# EAGLE design Sensorboard1 (EAGLE 9.2.2)
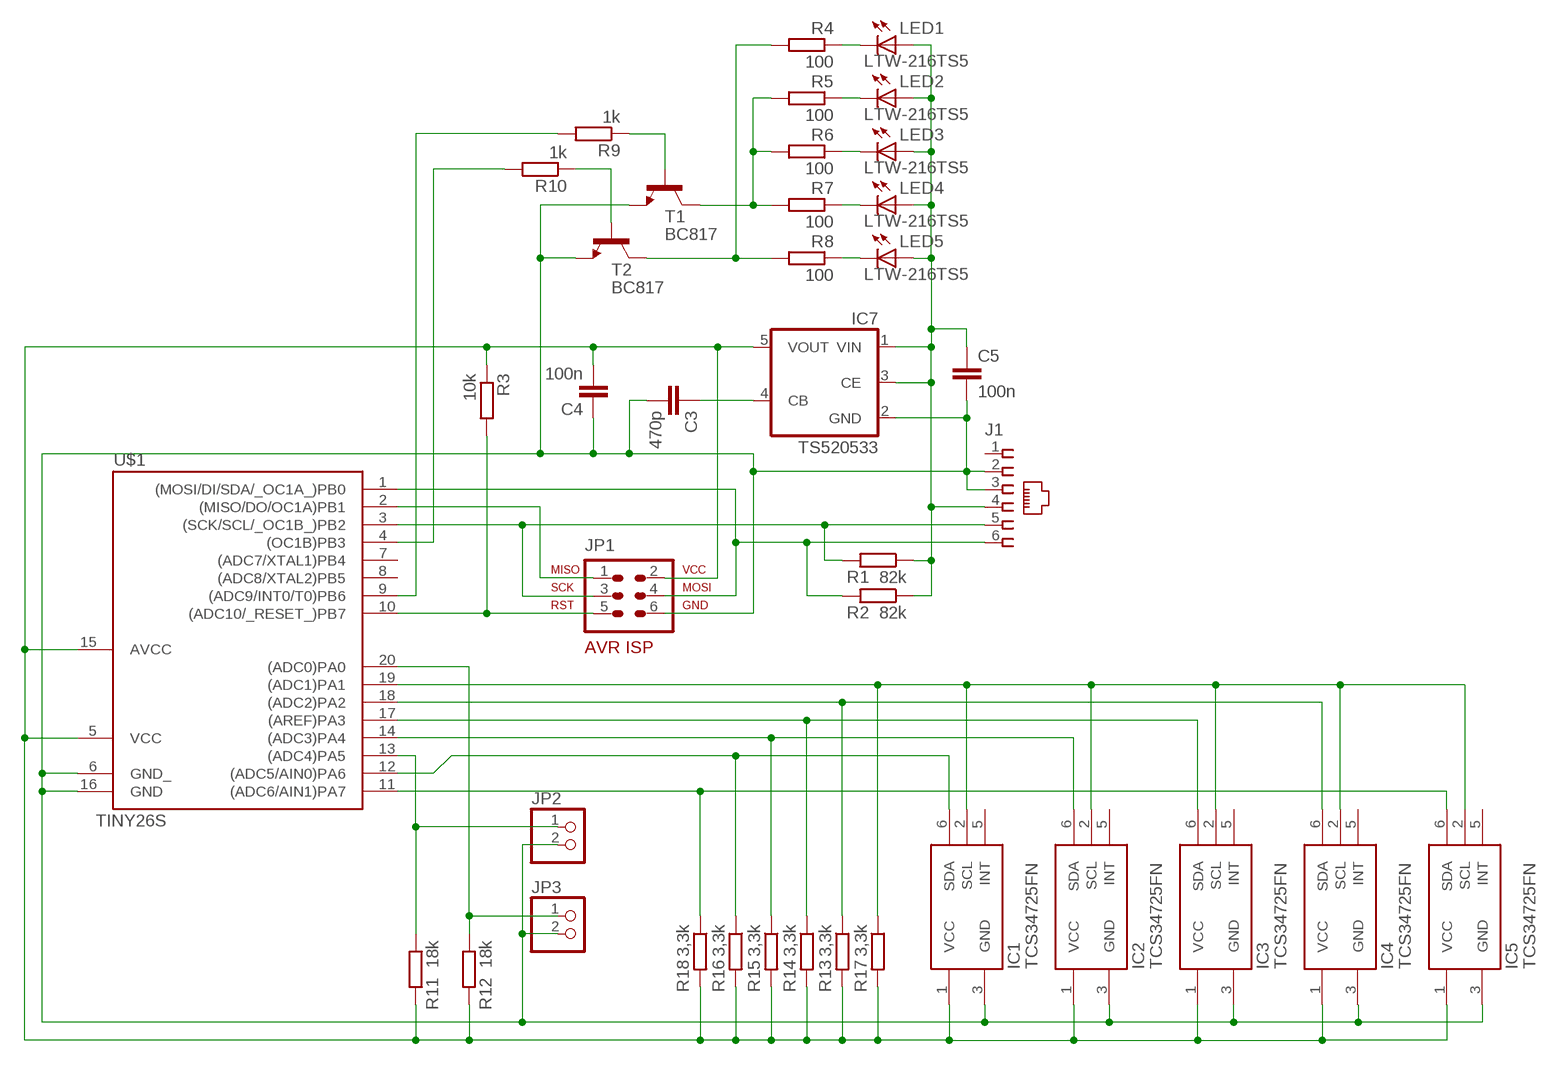
[diagram p0: schematic, sheet 1]

## Parts
C3  470p  C-EUC2012  [C2012]
C4  100n  C-EUC2012  [C2012]
C5  100n  C-EUC2012  [C2012]
IC1  TCS34725FN  TCS3472FN  [DFN-6]
IC2  TCS34725FN  TCS3472FN  [DFN-6]
IC3  TCS34725FN  TCS3472FN  [DFN-6]
IC4  TCS34725FN  TCS3472FN  [DFN-6]
IC5  TCS34725FN  TCS3472FN  [DFN-6]
IC7  TS520533  [SOT25]
J1  NXT  [NXT]
JP1  AVR-ISP-6VERT  [AVR-ISP-6]
JP2  PINHD-1X2  [1X02]
JP3  PINHD-1X2  [1X02]
LED1  LTW-216TS5  LEDCHIPLED_1206  [CHIPLED_1206]
LED2  LTW-216TS5  LEDCHIPLED_1206  [CHIPLED_1206]
LED3  LTW-216TS5  LEDCHIPLED_1206  [CHIPLED_1206]
LED4  LTW-216TS5  LEDCHIPLED_1206  [CHIPLED_1206]
LED5  LTW-216TS5  LEDCHIPLED_1206  [CHIPLED_1206]
R1  82k  R-EU_M0805  [M0805]
R2  82k  R-EU_M0805  [M0805]
R3  10k  R-EU_M0805  [M0805]
R4  100  R-EU_M0805  [M0805]
R5  100  R-EU_M0805  [M0805]
R6  100  R-EU_M0805  [M0805]
R7  100  R-EU_M0805  [M0805]
R8  100  R-EU_M0805  [M0805]
R9  1k  R-EU_M0805  [M0805]
R10  1k  R-EU_M0805  [M0805]
R11  18k  R-EU_M0805  [M0805]
R12  18k  R-EU_M0805  [M0805]
R13  3,3k  R-EU_M0805  [M0805]
R14  3,3k  R-EU_M0805  [M0805]
R15  3,3k  R-EU_M0805  [M0805]
R16  3,3k  R-EU_M0805  [M0805]
R17  3,3k  R-EU_M0805  [M0805]
R18  3,3k  R-EU_M0805  [M0805]
T1  BC817  BC846  [SOT23]
T2  BC817  BC846  [SOT23]
U$1  TINY26S  [SO20L$]

## Nets
3,3V: C4.2 IC1.1(VCC) IC2.1(VCC) IC3.1(VCC) IC4.1(VCC) IC5.1(VCC) IC7.5(VOUT) JP1.2 R3.1 R11.2 R12.2 R13.2 R14.2 R15.2 R16.2 R17.2 R18.2 U$1.5(VCC) U$1.15(AVCC)
4,3V: C5.1 IC7.1(VIN) IC7.3(CE) J1.4 LED1.A LED2.A LED3.A LED4.A LED5.A R1.1 R2.1
GND: C3.2 C4.1 C5.2 IC1.3(GND) IC2.3(GND) IC3.3(GND) IC4.3(GND) IC5.3(GND) IC7.2(GND) J1.2 J1.3 JP1.6 JP2.2 JP3.2 T1.2(E) T2.2(E) U$1.6(GND_) U$1.16(GND)
MISO: JP1.1 U$1.2((MISO/DO/OC1A)PB1)
N$1: LED1.C R4.1
N$2: LED2.C R5.1
N$3: LED3.C R6.1
N$4: LED4.C R7.1
N$5: LED5.C R8.1
N$6: R5.2 R6.2 R7.2 T1.3(C)
N$7: C3.1 IC7.4(CB)
N$8: R9.2 U$1.9((ADC9/INT0/T0)PB6)
N$9: R9.1 T1.1(B)
N$10: R4.2 R8.2 T2.3(C)
N$11: R10.1 T2.1(B)
N$12: R10.2 U$1.4((OC1B)PB3)
N$14: JP2.1 R11.1 U$1.13((ADC4)PA5)
N$15: JP3.1 R12.1 U$1.20((ADC0)PA0)
RESET: JP1.5 R3.2 U$1.10((ADC10/_RESET_)PB7)
SCL: IC1.2(SCL) IC2.2(SCL) IC3.2(SCL) IC4.2(SCL) IC5.2(SCL) R17.1 U$1.19((ADC1)PA1)
SCL/SCK: J1.5 JP1.3 R1.2 U$1.3((SCK/SCL/_OC1B_)PB2)
SDA1: IC1.6(SDA) R16.1 U$1.12((ADC5/AIN0)PA6)
SDA2: IC2.6(SDA) R15.1 U$1.14((ADC3)PA4)
SDA3: IC3.6(SDA) R14.1 U$1.17((AREF)PA3)
SDA4: IC4.6(SDA) R13.1 U$1.18((ADC2)PA2)
SDA5: IC5.6(SDA) R18.1 U$1.11((ADC6/AIN1)PA7)
SDA/MOSI: J1.6 JP1.4 R2.2 U$1.1((MOSI/DI/SDA/_OC1A_)PB0)
Unconnected: IC1.5(INT) IC2.5(INT) IC3.5(INT) IC4.5(INT) IC5.5(INT) J1.1 U$1.7((ADC7/XTAL1)PB4) U$1.8((ADC8/XTAL2)PB5)

## Library data of the parts
C3-C5 = resistor:C-EU: CAPACITOR, European symbol
IC1-IC5 = HyperTriangle:TCS3472: The TAOS inc. TCS3472 device provides a digital return of red, green, blue (RGB), and clear light sensing values. An IR blocking filter, integrated on-chip and localized to the color sensing photodiodes, minimizes the IR spectral wide component dynamic of the range, incoming and IR light blocking and allows filter make color measurements the TCS3472 an to ideal be made color accurately. sensor solution The high for sensitivity, use under varying lighting conditions and through attenuating materials. The TCS3472 color sensor has a wide range of applications including RGB LED backlight control, solid-state lighting, IR blocking health/fitness filter enables products, the TCS3472 industrial to perform processambient controls light and sensing medical (ALS). diagnostic Ambient equipment. light sensing In addition, is widely the used enable inautomatic display-based display products brightness such for as cell optimal phones, viewing notebooks, and power and savings. TVs to sense The TCS3472, the lighting itself, environment can enter and lower-power wait state between light sensing measurements to further reduce the average power consumption.
IC7 = v-reg:TS5205: 150mA Low Noise LDO Voltage Regulator with Enable TSC [Taiwan Semiconductor Company, Ltd] Source: http://www.taiwansemi.com .. 5205_0409c.pdf
J1 = NXT:NXT: 6 Pin RJ-12 Connector for Lego Mindstorms NXT 6/6 Western Telephone Jack
JP1 = avr-7:AVR-ISP-6: AVR ISP-6 Serial Programming Header
JP2 JP3 = pinhead:PINHD-1X2: PIN HEADER
LED1-LED5 = led:LED: LED OSRAM: - CHIPLED LG R971, LG N971, LY N971, LG Q971, LY Q971, LO R971, LY R971 LH N974, LH R974 LS Q976, LO Q976, LY Q976 LO Q996 - Hyper CHIPLED LW Q18S LB Q993, LB Q99A, LB R99A - SideLED LS A670, LO A670, LY A670, LG A670, LP A670 LB A673, LV A673, LT A673, LW A673 LH A674 LY A675 LS A676, LA A676, LO A676, LY A676, LW A676 LS A679, LY A679, LG A679 - Hyper Micro SIDELED® LS Y876, LA Y876, LO Y876, LY Y876 LT Y87S - SmartLED LW L88C, LW L88S LB L89C, LB L89S, LG L890 LS L89K, LO L89K, LY L89K LS L896, LA L896, LO L896, LY L896 - TOPLED LS T670, LO T670, LY T670, LG T670, LP T670 LSG T670, LSP T670, LSY T670, LOP T670, LYG T670 LG T671, LOG T671, LSG T671 LB T673, LV T673, LT T673, LW T673 LH T674 LS T676, LA T676, LO T676, LY T676, LB T676, LH T676, LSB T676, LW T676 LB T67C, LV T67C, LT T67C, LS T67K, LO T67K, LY T67K, LW E67C LS E67B, LA E67B, LO E67B, LY E67B, LB E67C, LV E67C, LT E67C LW T67C LS T679, LY T679, LG T679 LS T770, LO T770, LY T770, LG T770, LP T770 LB T773, LV T773, LT T773, LW T773 LH T774 LS E675, LA E675, LY E675, LS T675 LS T776, LA T776, LO T776, LY T776, LB T776 LHGB T686 LT T68C, LB T68C - Hyper Mini TOPLED® LB M676 - Mini TOPLED Santana® LG M470 LS M47K, LO M47K, LY M47K Source: http://www.osram.convergy.de LUXEON: - LUMILED® LXK2-PW12-R00, LXK2-PW12-S00, LXK2-PW14-U00, LXK2-PW14-V00 LXK2-PM12-R00, LXK2-PM12-S00, LXK2-PM14-U00 LXK2-PE12-Q00, LXK2-PE12-R00, LXK2-PE12-S00, LXK2-PE14-T00, LXK2-PE14-U00 LXK2-PB12-K00, LXK2-PB12-L00, LXK2-PB12-M00, LXK2-PB14-N00, LXK2-PB14-P00, LXK2-PB14-Q00 LXK2-PR12-L00, LXK2-PR12-M00, LXK2-PR14-Q00, LXK2-PR14-R00 LXK2-PD12-Q00, LXK2-PD12-R00, LXK2-PD12-S00 LXK2-PH12-R00, LXK2-PH12-S00 LXK2-PL12-P00, LXK2-PL12-Q00, LXK2-PL12-R00 Source: www.luxeon.com KINGBRIGHT: KA-3528ASYC Source: www.kingbright.com
R1-R18 = resistor:R-EU_: RESISTOR, European symbol
T1 T2 = transistor:BC846: NPN TRANSISTOR
U$1 = avr-7:TINY26: Atmel Tiny26/261/461/861

## Board
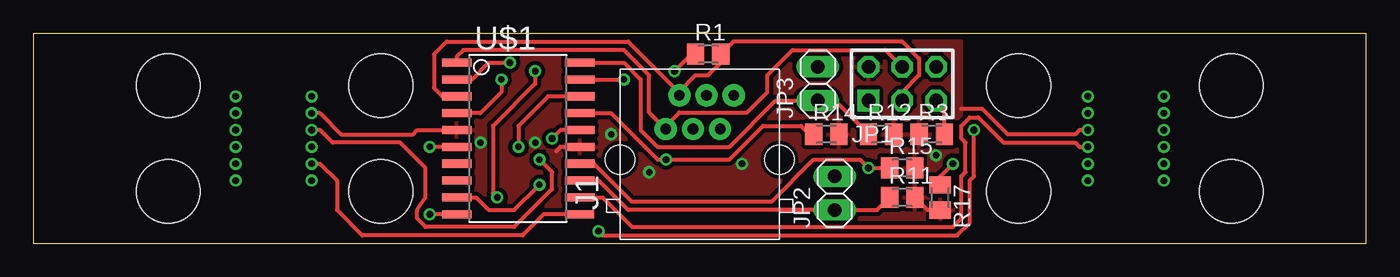
[diagram p1: board, top side]
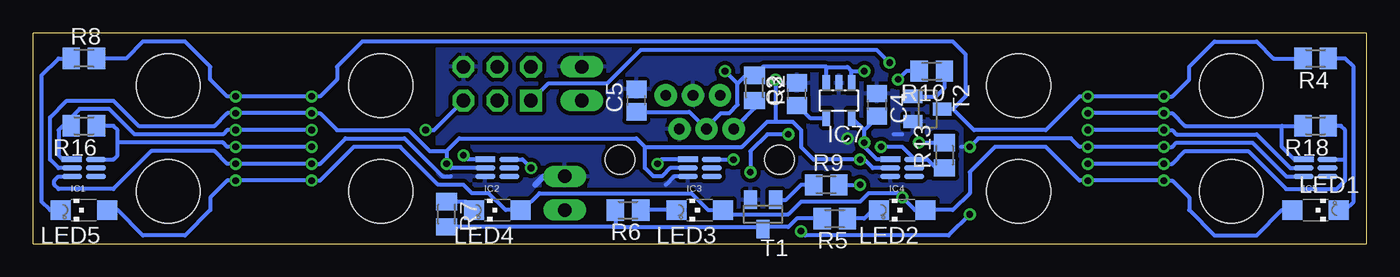
[diagram p2: board, bottom side, seen from below]

Size 100.33 x 15.88 mm. Coordinates in mm from the lower left corner, seen from the top.
Outline: 0,15.88 100.33,15.88 100.33,0 0,0 0,15.88
Copper layers (1*16): Top 0.035mm / dielectric 1.5mm / Bottom 0.035mm
Design rules "default *": minimum track width 10mil, minimum drill 19mil, track to track 8mil, track to pad 8mil, pad to pad 8mil, via to via 8mil, smd to smd 8mil, copper to edge 12mil, drill to drill 12mil, minimum pad ring 12mil, minimum via ring 8mil, stop-mask expansion 4mil, vias tented up to drill 0mil, thermal gap 10mil
Holes 4.8 mm at 74.17,11.94 74.17,3.94 26.16,11.94 26.16,3.94 90.17,11.94 90.17,3.94 10.16,11.94 10.16,3.94

### Footprints (pad centres in the part's own frame; a part is rotated, then mirrored left to right if it is on the bottom)
C2012 = smd 1.3 x 1.5: 1 -0.85,0; 2 0.85,0
DFN-6 = smd 1.5 x 0.4: 1 -0.9,0.65; 2 -0.9,0; 3 -0.9,-0.65; 4 0.9,-0.65; 5 0.9,0; 6 0.9,0.65
SOT25 = smd 0.55 x 1.2: 1 -0.95,-1.3; 2 0,-1.3; 3 0.95,-1.3; 4 0.95,1.3; 5 -0.95,1.3
NXT = drill 0.8 pad 1.676: 1 2.55,4.84; 2 1.53,2.3; 3 0.51,4.84; 4 -0.51,2.3; 5 -1.53,4.84; 6 -2.55,2.3 | hole 2.2: -6,0; 6,0
AVR-ISP-6 = drill 1.016 square: 1 -2.54,-1.27 | drill 1.016 octagon: 2 -2.54,1.27; 3 0,-1.27; 4 0,1.27; 5 2.54,-1.27; 6 2.54,1.27
1X02 = drill 1.016 long: 1 -1.27,0; 2 1.27,0
CHIPLED_1206 = smd 1.5 x 1.5: A 0,-1.75; C 0,1.75
M0805 = smd 1.3 x 1.6: 1 -0.95,0; 2 0.95,0
SOT23 = smd 1 x 1.4: 1 -0.95,-1.1; 2 0.95,-1.1; 3 0,1.1
SO20L$ = smd 0.61 x 2.21: 1 -5.715,-4.636; 2 -4.445,-4.636; 3 -3.175,-4.636; 4 -1.905,-4.636; 5 -0.635,-4.636; 6 0.635,-4.636; 7 1.905,-4.636; 8 3.175,-4.636; 9 4.445,-4.636; 10 5.715,-4.636; 11 5.715,4.61; 12 4.445,4.636; 13 3.175,4.636; 14 1.905,4.636; 15 0.635,4.636; 16 -0.635,4.636; 17 -1.905,4.636; 18 -3.175,4.636; 19 -4.445,4.636; 20 -5.715,4.636

### Placement (x,y rotation side)
C3  42.86,11.27 90 bottom
C4  36.83,10.48 270 bottom
C5  54.93,10.79 90 bottom
IC1  96.52,5.71 0 bottom
IC2  65.41,5.71 0 bottom
IC3  50.16,5.71 0 bottom
IC4  34.92,5.71 0 bottom
IC5  3.81,5.71 0 bottom
IC7  39.69,10.79 180 bottom
J1  50.16,6.35 0 top
JP1  65.41,12.06 0 top
JP2  60.33,3.81 90 top
JP3  59.05,12.06 90 top
LED1  3.81,2.54 270 bottom
LED2  34.92,2.54 90 bottom
LED3  50.16,2.54 90 bottom
LED4  65.41,2.54 90 bottom
LED5  96.52,2.54 90 bottom
R1  50.8,14.29 0 top
R2  46.04,11.75 270 bottom
R3  67.63,8.26 0 top
R4  3.81,13.97 180 bottom
R5  40.01,1.91 180 bottom
R6  55.56,2.54 180 bottom
R7  69.22,2.22 270 bottom
R8  96.52,13.97 0 bottom
R9  40.64,4.45 0 bottom
R10  32.7,13.02 180 bottom
R11  65.41,3.49 0 top
R12  63.82,8.26 0 top
R13  31.75,6.67 90 bottom
R14  59.69,8.26 0 top
R15  65.41,5.71 0 top
R16  96.52,8.89 180 bottom
R17  68.26,3.49 270 top
R18  3.81,8.89 180 bottom
T1  45.4,2.22 180 bottom
T2  33.02,10.16 270 bottom
U$1  36.51,7.94 270 top

### Tracks (layer width: path | path; a pad name or v marks a point on that pad's centre or on a via)
3,3V  (via drill 0.5)
  Top 0.305: v20.95,9.84 21.59,9.84 23.18,8.26 28.57,8.26 28.89,8.57 U$1.5 | U$1.15 39.69,7.3 39.37,6.99 | R17.2 67.31,2.54 R11.2 | v79.38,8.57 78.74,8.57 78.42,8.26 73.34,8.26 71.44,10.16 69.85,10.16
  Bottom 0.305: IC3.1 53.01,6.37 v53.34,6.03 | IC2.1 67.61,6.37 v67.94,6.67 | IC4.1 36.84,6.37 37.78,7.3 v37.78,7.62 37.78,8.57 | v43.5,8.26 45.09,8.26 46.35,6.99 v46.35,5.4 | v33.66,7.62 33.34,7.62 R13.2 | C4.2 36.83,9.53 37.78,8.57 | IC7.5 38.7,9.5 37.78,8.57 | 6.35,8.89 13.65,8.89 14.61,9.84 v15.24,9.84 v20.95,9.84 | 6.35,8.89 R18.2 | IC1.1 98.12,6.37 98.42,6.67 98.42,8.57 98.11,8.89 R16.2 97.47,9.53 96.84,10.16 94.61,10.16 92.71,8.26 86.04,8.26 85.72,8.57 v85.09,8.57 v79.38,8.57 | 6.35,8.89 6.35,7.3 5.41,6.37 IC5.1
  pour Top (isolate 0.305): 30.48,0.64 69.85,0.64 69.85,15.24 30.48,15.24
4,3V  (via drill 0.5)
  Top 0.305: v37.78,13.02 37.78,12.06 34.61,8.89 34.61,3.81 v34.92,3.49 | R1.1 49.53,14.29 v48.26,13.02
  Bottom 0.305: 47.31,12.06 47.31,10.48 47.94,9.84 48.58,9.84 49.66,8.77 J1.4 50.95,9.95 C5.1 | IC7.1 38.74,13.02 | IC7.3 40.64,13.33 | 40.64,13.33 40.64,13.34 45.4,13.34 R2.1 46.67,12.7 47.31,12.06 | 38.74,13.02 39.05,13.34 39.05,13.33 40.64,13.33 | 38.74,13.02 v37.78,13.02 | LED3.A 48.26,2.38 | LED3.A 49.53,2.54 50.8,3.81 62.23,3.81 63.5,2.54 LED4.A 64.77,2.54 66.04,3.81 67.31,3.81 67.94,4.45 69.85,4.45 72.71,7.3 76.2,7.3 78.74,4.76 v79.38,4.76 v85.09,4.76 85.72,4.76 87,3.49 87,2.54 88.9,0.64 92.08,0.64 93.98,2.54 LED5.A | LED3.A 48.1,2.22 43.5,2.22 42.55,3.17 38.1,3.17 37.47,3.81 35.24,3.81 v34.92,3.49 33.97,2.54 LED2.A 31.11,2.54 29.84,3.81 29.84,5.4 27.94,7.3 24.13,7.3 21.59,4.76 v20.95,4.76 v15.24,4.76 14.61,4.76 13.34,3.49 13.34,2.54 11.43,0.64 8.26,0.64 6.35,2.54 LED1.A | v48.26,13.02 47.31,12.06
GND  (via drill 0.5)
  Top 0.305: U$1.16 39.69,8.57 v39.05,7.94 | U$1.6 v29.84,7.3
  Bottom 0.305: 34.92,8.26 35.56,8.26 | 30.48,7.3 v29.84,7.3 29.21,7.94 22.23,7.94 21.59,7.3 v20.95,7.3 v15.24,7.3 14.61,7.3 14.29,7.62 8.57,7.62 6.02,5.07 IC5.3 | 68.9,5.08 69.53,5.08 72.39,7.94 76.83,7.94 78.74,6.03 v79.38,6.03 v85.09,6.03 85.72,6.03 86.68,6.99 91.44,6.99 94.3,4.13 98.42,4.13 98.74,4.45 98.74,4.76 98.44,5.07 IC1.3 | IC3.3 52.09,5.07 52.7,4.45
  Bottom 0.406: JP2.2 61.91,5.08 62.55,4.45
  pour Bottom (isolate 0.305): 30.48,15.24 30.48,0.64 69.85,0.64 69.85,15.24
MISO  (via drill 0.5)
  Top 0.305: U$1.2 33.02,12.38 34.29,13.65 v35.88,13.65
  Bottom 0.305: v35.88,13.65 36.83,14.61 54.61,14.61 57.15,12.06 61.59,12.06 JP1.1
N$1
  Bottom 0.305: LED1.C 1.59,2.54 0.95,3.17 0.95,13.34 1.59,13.97 R4.1
N$2
  Bottom 0.305: LED2.C 37.15,2.54 37.78,1.91 R5.1
N$3
  Bottom 0.305: LED3.C R6.1
N$4
  Bottom 0.305: LED4.C 67.79,3.17 R7.1
N$5
  Bottom 0.305: LED5.C 99.06,2.54 99.69,3.17 99.69,12.7 98.42,13.97 R8.1
N$6
  Bottom 0.305: R6.2 56.51,1.27 | 56.51,1.27 55.88,1.27 45.87,1.27 T1.3 45.57,1.27 43.5,1.27 42.86,1.91 R5.2 | 56.51,1.27 66.04,1.27 | 66.04,1.27 | 66.04,1.27 R7.2
N$7
  Bottom 0.305: C3.1 42.81,10.42 41.88,9.5 IC7.4
N$8  (via drill 0.5)
  Top 0.305: U$1.9 33.34,3.49 34.29,2.54 36.2,2.54 v38.1,4.45
  Bottom 0.305: R9.2 v38.1,4.45
N$9
  Bottom 0.305: R9.1 42.55,4.45 43.67,3.32 T1.1
N$10  (via drill 0.5)
  Bottom 0.305: 31.75,10.16 T2.3 31.11,10.16 | 31.11,10.16 30.16,11.11 30.16,14.29 31.11,15.24 75.56,15.24 77.47,13.34 77.47,12.38 78.74,11.11 v79.38,11.11 v85.09,11.11 85.72,11.11 87,12.38 87,13.34 88.9,15.24 92.08,15.24 93.34,13.97 R8.2 | 31.11,10.16 29.53,8.57 24.13,8.57 21.59,11.11 v20.95,11.11 v15.24,11.11 14.61,11.11 13.34,12.38 13.34,13.34 11.43,15.24 8.26,15.24 6.99,13.97 R4.2
N$11
  Bottom 0.305: T2.1 32.39,11.11 31.75,11.75 R10.1
N$12  (via drill 0.5)
  Top 0.305: v35.24,12.38 35.24,11.43 33.66,9.84 U$1.4
  Bottom 0.305: R10.2 34.61,13.02 v35.24,12.38
N$14
  Top 0.305: U$1.13 42.55,4.76 44.77,2.54 JP2.1 63.5,2.54 R11.1
N$15
  Top 0.305: U$1.20 44.45,13.65 45.72,12.38 45.72,8.57 46.99,7.3 52.39,7.3 55.88,10.79 JP3.1 60.33,10.79 62.55,8.57 R12.1
RESET  (via drill 0.5)
  Top 0.305: v42.55,0.95 42.86,0.64 69.53,0.64 70.48,1.59 70.48,4.76 70.8,5.08 v70.8,8.57 | U$1.10 v29.84,2.22 | JP1.5 68.58,10.16 R3.2
  Bottom 0.305: v42.55,0.95 42.23,0.64 31.43,0.64 v29.84,2.22 | v70.8,8.57 70.17,8.57 JP1.5
SCL  (via drill 0.5)
  Top 0.305: U$1.19 v44.45,12.38 | v20.95,8.57 21.59,8.57 22.54,7.62 27.62,7.62 29.53,5.71 29.53,3.49 28.89,2.54 28.89,1.91 29.53,1.27 36.2,1.27 39.05,4.13 39.05,5.4 v38.1,6.35 | R17.1 68.26,5.08 v69.22,6.03
  Bottom 0.305: IC3.2 52.39,5.71 53.02,5.08 53.66,5.08 54.29,5.71 54.29,7.3 | 54.29,7.3 46.99,7.3 45.09,9.21 44.45,9.21 | v44.45,12.38 44.45,9.21 | IC2.2 68.9,5.71 v69.22,6.03 69.22,6.99 | 54.29,7.3 54.93,7.94 68.26,7.94 69.22,6.99 | 44.45,9.21 43.18,9.21 42.55,8.57 42.55,7.3 41.59,6.35 v38.1,6.35 37.78,6.35 37.15,5.71 IC4.2 | 69.22,6.99 70.48,6.99 72.07,8.57 77.47,8.57 78.74,9.84 v79.38,9.84 v85.09,9.84 85.72,9.84 86.68,8.89 92.39,8.89 94.3,10.79 97.79,10.79 99.06,9.53 99.06,6.35 98.42,5.71 IC1.2 | IC5.2 5.71,5.71 8.26,8.26 14.29,8.26 14.61,8.57 v15.24,8.57 v20.95,8.57
SCL/SCK
  Top 0.305: U$1.3 30.8,11.11 30.16,11.75 30.16,14.29 31.11,15.24 44.77,15.24 48.63,11.37 J1.5 48.63,11.49 49.85,12.7 50.8,12.7 51.75,13.65 R1.2 52.7,15.24 65.41,15.24 66.67,13.97 66.67,12.7 65.41,11.43 JP1.3
SDA1  (via drill 0.5)
  Top 0.305: U$1.12 42.86,3.49 45.09,1.27 69.22,1.27 69.85,1.91 69.85,5.08 70.17,5.4 70.17,7.62 69.85,7.94 69.85,8.89 70.48,9.53 71.12,9.53 73.03,7.62 78.42,7.62 78.74,7.3 v79.38,7.3
  Bottom 0.305: 93.98,7.62 93.98,6.67 94.28,6.37 IC1.6 | 93.98,7.62 93.98,8.57 94.3,8.89 R16.1 | 93.98,7.62 86.04,7.62 85.72,7.3 v85.09,7.3 v79.38,7.3
SDA2  (via drill 0.5)
  Top 0.305: R15.1 v62.87,5.71 62.23,6.35 58.74,6.35 55.56,3.17 45.09,3.17 42.23,6.03 U$1.14
  Bottom 0.305: IC2.6 63.52,6.37 v62.87,5.71
SDA3  (via drill 0.5)
  Top 0.305: U$1.17 43.5,9.84 46.99,6.35 v47.62,6.35 52.39,6.35 54.93,8.89 57.78,8.89 58.42,8.26 R14.1
  Bottom 0.305: IC3.6 47.64,6.37 v47.62,6.35
SDA4  (via drill 0.5)
  Top 0.305: U$1.18 38.73,11.11 36.51,8.89 v36.51,7.3
  Bottom 0.305: v36.51,7.3 34.92,7.3 34.02,6.4 IC4.6 33.03,6.37 32.39,5.72 R13.1
SDA5  (via drill 0.5)
  Top 0.305: U$1.11 38.42,2.22 36.83,0.64 24.77,0.64 22.86,2.54 22.86,4.76 21.59,6.03 v20.95,6.03
  Bottom 0.305: 1.59,6.35 1.59,4.76 2.22,4.13 6.03,4.13 8.89,6.99 13.65,6.99 14.61,6.03 v15.24,6.03 v20.95,6.03 | 1.59,6.35 1.59,8.57 1.91,8.89 R18.1 | IC5.6 1.6,6.37 1.59,6.35
SDA/MOSI
  Top 0.305: JP1.4 64.14,14.61 57.15,14.61 55.24,12.7 55.24,11.43 53.72,9.91 48.64,9.91 47.62,8.88 J1.6 46.35,9.91 46.35,12.7 44.45,14.61 32.38,14.61 31.88,14.1 U$1.1
  Bottom 0.305: 46.74,9.53 J1.6 46.04,10.23 R2.2